# EAGLE schematic TeamD_PCBSchematic (EAGLE 8.3.2)
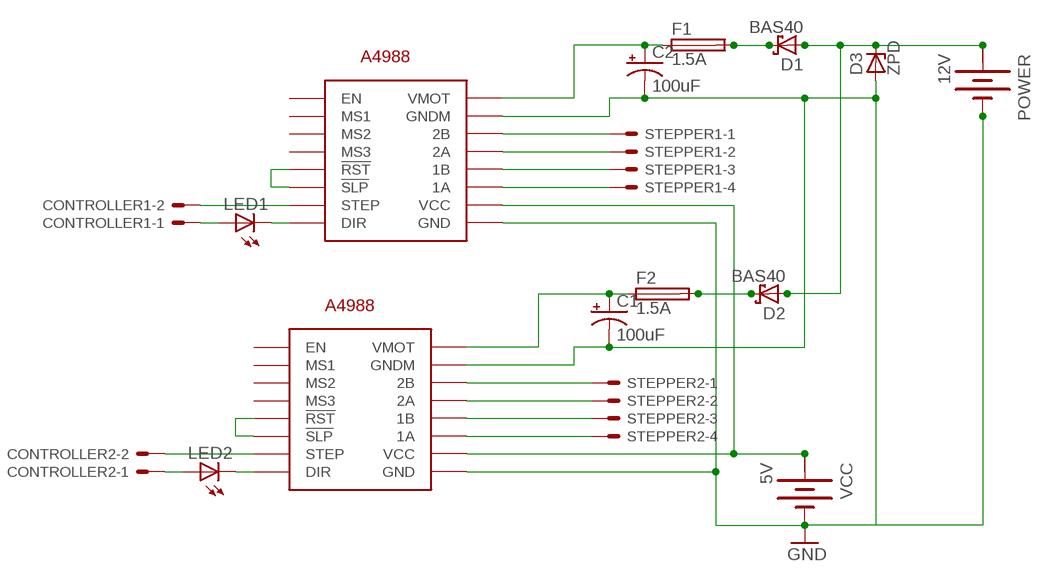
[diagram p0: schematic, sheet 1]

## Parts
C1  100uF  CPOL-USE15-5AXIAL  [E15-5]
C2  100uF  CPOL-USE15-5AXIAL  [E15-5]
CONTROLLER1  22-23-2021  [22-23-2021]
CONTROLLER2  22-23-2021  [22-23-2021]
D1  BAS40  [SOT23]
D2  BAS40  [SOT23]
D3  ZPD  [DO35Z10]
F1  1.5A  19559  [19559]
F2  1.5A  19559  [19559]
LED1  LED  [SMARTLED-TTW]
LED2  LED  [SMARTLED-TTW]
POWER  12V  BATTERY  [BATTERY]
STEPPER1  22-23-2041  [22-23-2041]
STEPPER2  22-23-2041  [22-23-2041]
U$1  STEP-STICK  [STEP-STICK]
U$2  STEP-STICK  [STEP-STICK]
VCC  5V  BATTERY  [BATTERY]

## Nets
N$1: CONTROLLER1.2 U$1.SPT(STEP)
N$2: CONTROLLER1.1 LED1.A@1(A)
N$3: CONTROLLER2.2 U$2.SPT(STEP)
N$4: CONTROLLER2.1 LED2.A@1(A)
N$5: U$1.RST(!RST) U$1.SLP(!SLP)
N$6: U$2.RST(!RST) U$2.SLP(!SLP)
N$7: STEPPER2.1 U$2.2B
N$8: STEPPER2.2 U$2.2A
N$9: STEPPER2.3 U$2.1B
N$10: STEPPER2.4 U$2.1A
N$11: STEPPER1.1 U$1.2B
N$12: STEPPER1.2 U$1.2A
N$13: STEPPER1.3 U$1.1B
N$14: STEPPER1.4 U$1.1A
N$15: D1.3(C) F1.2
N$17: LED1.C@1(C) U$1.DIR
N$18: LED2.C@1(C) U$2.DIR
N$19: C2.+ F1.1 U$1.VMOT
N$20: C1.+ F2.1 U$2.VMOT
N$21: U$1.VCC U$2.VCC VCC.+
N$22: D2.3(C) F2.2
N$25: D1.1(A) D2.1(A) D3.C POWER.+
N$27: C1.- C2.- D3.A POWER.- U$1.GND U$1.GNDM U$2.GND U$2.GNDM VCC.-
Unconnected: U$1.EN U$1.MS1 U$1.MS2 U$1.MS3 U$2.EN U$2.MS1 U$2.MS2 U$2.MS3

## Power pins joined to a net without a drawn wire
+: POWER.+@1(+) VCC.+@1(+)

## Library data of the parts
C1 C2 = rcl:CPOL-US: POLARIZED CAPACITOR, American symbol
CONTROLLER1 CONTROLLER2 = con-molex:22-23-2021: .100" (2.54mm) Center Header - 2 Pin; MF: MOLEX; MPN: 22-23-2021; OC_FARNELL: 1462926; OC_NEWARK: 25C3832
D1 D2 = diode:BAS40: Silicon Schottky Diodes General-purpose diode for high-speed switching
D3 = diode:ZPD: Z DIODE 500 mW
F1 F2 = fuse:19559: FUSE HOLDER TR5, Wickmann; MPN: 55900000001; OC_FARNELL: 9516360; OC_NEWARK: 02P0286
LED1 LED2 = led:LED: LED OSRAM: - CHIPLED LG R971, LG N971, LY N971, LG Q971, LY Q971, LO R971, LY R971 LH N974, LH R974 LS Q976, LO Q976, LY Q976 LO Q996 - Hyper CHIPLED LW Q18S LB Q993, LB Q99A, LB R99A - SideLED LS A670, LO A670, LY A670, LG A670, LP A670 LB A673, LV A673, LT A673, LW A673 LH A674 LY A675 LS A676, LA A676, LO A676, LY A676, LW A676 LS A679, LY A679, LG A679 - Hyper Micro SIDELED® LS Y876, LA Y876, LO Y876, LY Y876 LT Y87S - SmartLED LW L88C, LW L88S LB L89C, LB L89S, LG L890 LS L89K, LO L89K, LY L89K LS L896, LA L896, LO L896, LY L896 - TOPLED LS T670, LO T670, LY T670, LG T670, LP T670 LSG T670, LSP T670, LSY T670, LOP T670, LYG T670 LG T671, LOG T671, LSG T671 LB T673, LV T673, LT T673, LW T673 LH T674 LS T676, LA T676, LO T676, LY T676, LB T676, LH T676, LSB T676, LW T676 LB T67C, LV T67C, LT T67C, LS T67K, LO T67K, LY T67K, LW E67C LS E67B, LA E67B, LO E67B, LY E67B, LB E67C, LV E67C, LT E67C LW T67C LS T679, LY T679, LG T679 LS T770, LO T770, LY T770, LG T770, LP T770 LB T773, LV T773, LT T773, LW T773 LH T774 LS E675, LA E675, LY E675, LS T675 LS T776, LA T776, LO T776, LY T776, LB T776 LHGB T686 LT T68C, LB T68C - Hyper Mini TOPLED® LB M676 - Mini TOPLED Santana® LG M470 LS M47K, LO M47K, LY M47K Source: http://www.osram.convergy.de LUXEON: - LUMILED® LXK2-PW12-R00, LXK2-PW12-S00, LXK2-PW14-U00, LXK2-PW14-V00 LXK2-PM12-R00, LXK2-PM12-S00, LXK2-PM14-U00 LXK2-PE12-Q00, LXK2-PE12-R00, LXK2-PE12-S00, LXK2-PE14-T00, LXK2-PE14-U00 LXK2-PB12-K00, LXK2-PB12-L00, LXK2-PB12-M00, LXK2-PB14-N00, LXK2-PB14-P00, LXK2-PB14-Q00 LXK2-PR12-L00, LXK2-PR12-M00, LXK2-PR14-Q00, LXK2-PR14-R00 LXK2-PD12-Q00, LXK2-PD12-R00, LXK2-PD12-S00 LXK2-PH12-R00, LXK2-PH12-S00 LXK2-PL12-P00, LXK2-PL12-Q00, LXK2-PL12-R00 Source: www.luxeon.com KINGBRIGHT: KA-3528ASYC Source: www.kingbright.com
POWER VCC = special:BATTERY: BATTERY
STEPPER1 STEPPER2 = con-molex:22-23-2041: .100" (2.54mm) Center Header - 4 Pin; MF: MOLEX; MPN: 22-23-2041; OC_FARNELL: 1462920; OC_NEWARK: 38C0355
U$1 U$2 = Arduino-clone:STEP-STICK

## Net classes
0 default: width 1.778 mm